# EAGLE design senseMini_future (EAGLE 9.1.1)
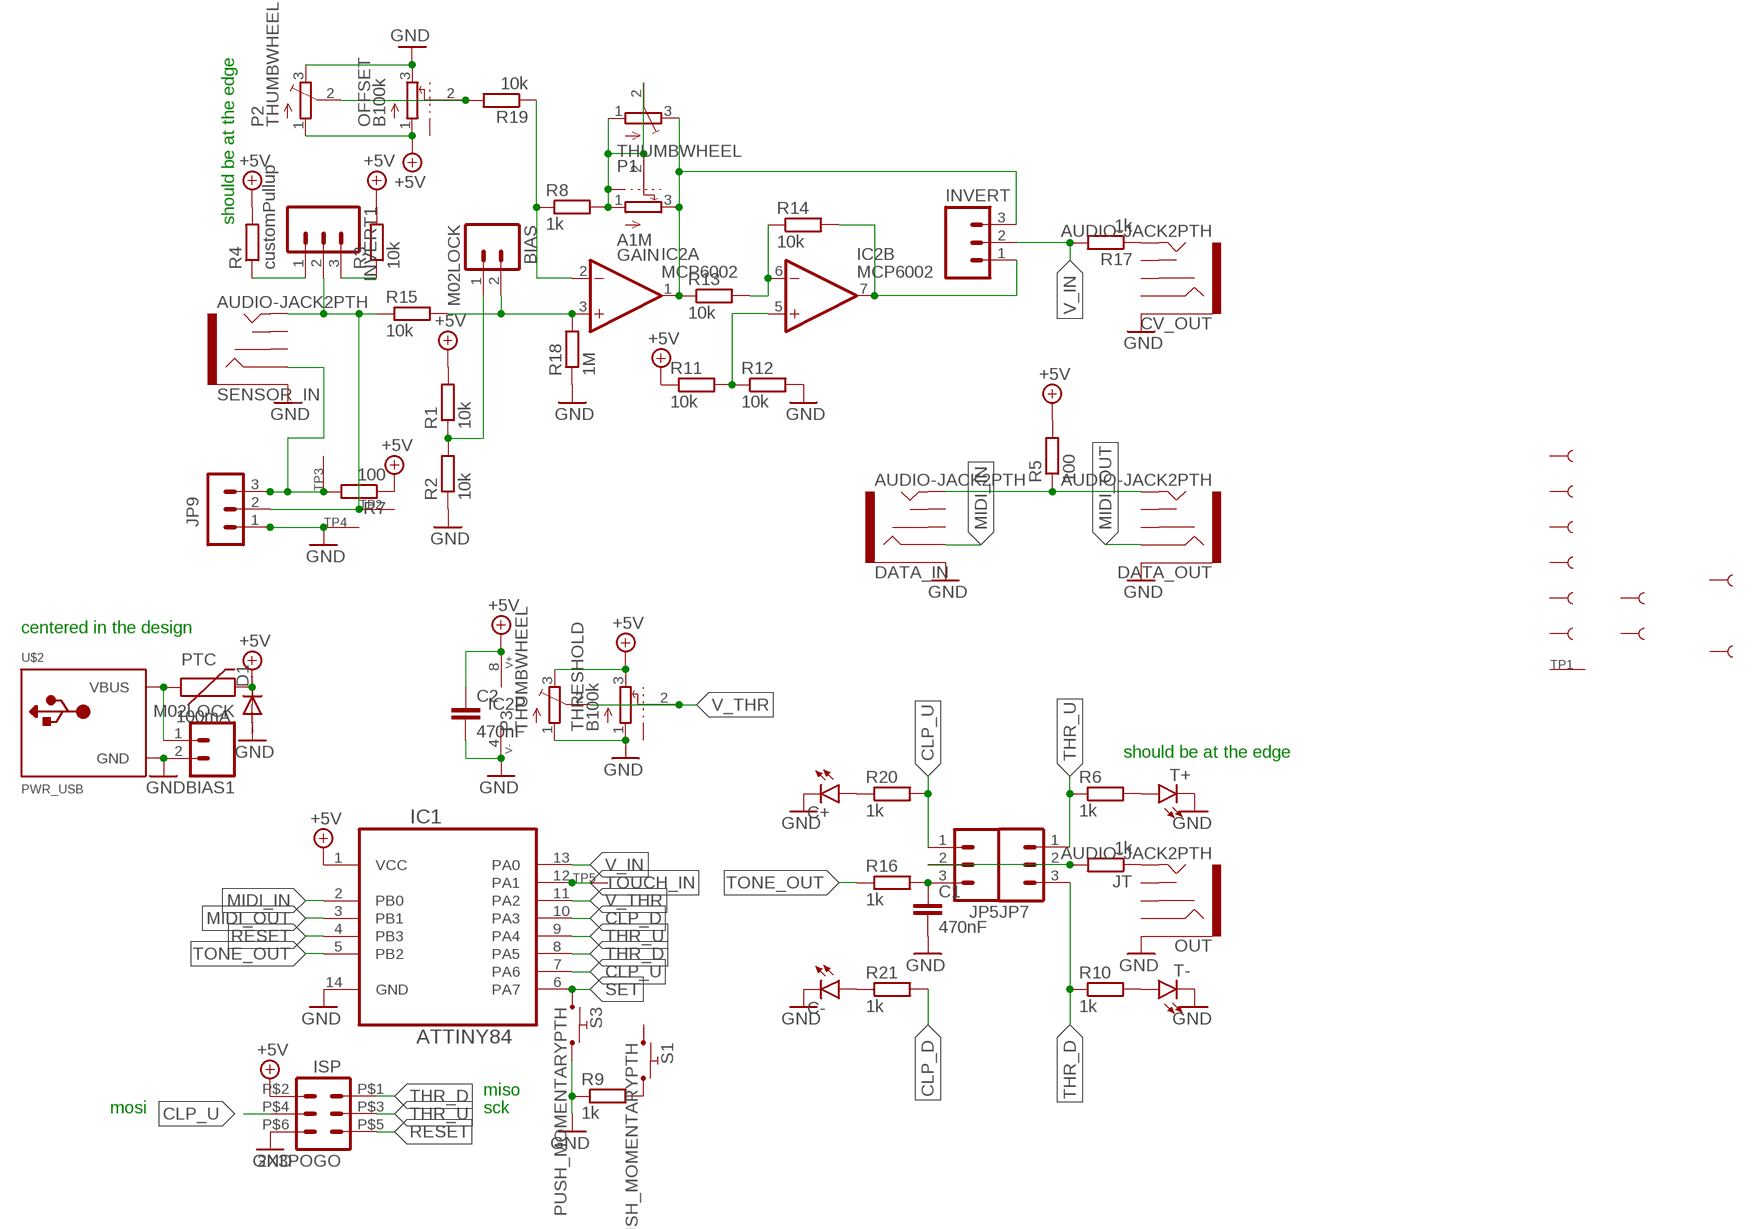
[diagram p0: schematic, sheet 1]

## Parts
BIAS  M02LOCK  [1X02_LOCK]
BIAS1  M02LOCK  [1X02_LOCK]
C1  470nF  CAPACITOR_CERAMIC_THT050-024X044  [C_C050-024X044]
C2  470nF  CAPACITOR_CERAMIC_THT050-024X044  [C_C050-024X044]
C+  LED_THT  [LEDSMALLHOLES]
C-  LED_THT  [LEDSMALLHOLES]
CV_OUT  AUDIO-JACK2PTH  [AUDIO-JACK]
D1  DIODE-D-5  [D-5]
DATA_IN  AUDIO-JACK2PTH  [AUDIO-JACK]
DATA_OUT  AUDIO-JACK2PTH  [AUDIO-JACK]
GAIN  A1M  POT_ALPHAPOT_ALPHA  [POT_ALPHA]
IC1  ATTINY84  ATTINY84-20PU  [DIP254P762X533-14]
IC2  MCP6002  TL072  [DIL08]
INVERT  M03LOCK  [1X03_LOCK]
INVERT1  M03LOCK  [1X03_LOCK]
ISP  2X3POGO  [2X3_POGO]
JP5  M03LOCK  [1X03_LOCK]
JP7  M03LOCK  [1X03_LOCK]
JP9  1X3_FEMALE  [HEADER_1X3_FEMALE]
JT  1k  RESISTOR_0204_THT0204/5  [RCL_0204/5]
OFFSET  B100k  POT_ALPHAPOT_ALPHA  [POT_ALPHA]
OUT  AUDIO-JACK2PTH  [AUDIO-JACK]
P1  THUMBWHEEL  [THUMBWHEEL]
P2  THUMBWHEEL  [THUMBWHEEL]
P3  THUMBWHEEL  [THUMBWHEEL]
PTC  100mA  PTC_THTPTH  [PTC_THT]
R1  10k  RESISTOR_0204_THT0204/5  [RCL_0204/5]
R2  10k  RESISTOR_0204_THT0204/5  [RCL_0204/5]
R3  10k  RESISTOR_0204_THT0204/5  [RCL_0204/5]
R4  customPullup  RESISTOR_0204_THT0204/5  [RCL_0204/5]
R5  100  RESISTOR_0204_THT0204/5  [RCL_0204/5]
R6  1k  RESISTOR_0204_THT0204/5  [RCL_0204/5]
R7  100  RESISTOR_0204_THT0204/5  [RCL_0204/5]
R8  1k  RESISTOR_0204_THT0204/5  [RCL_0204/5]
R9  1k  RESISTOR_0204_THT0204/5  [RCL_0204/5]
R10  1k  RESISTOR_0204_THT0204/5  [RCL_0204/5]
R11  10k  RESISTOR_0204_THT0204/5  [RCL_0204/5]
R12  10k  RESISTOR_0204_THT0204/5  [RCL_0204/5]
R13  10k  RESISTOR_0204_THT0204/5  [RCL_0204/5]
R14  10k  RESISTOR_0204_THT0204/5  [RCL_0204/5]
R15  10k  RESISTOR_0204_THT0204/5  [RCL_0204/5]
R16  1k  RESISTOR_0204_THT0204/5  [RCL_0204/5]
R17  1k  RESISTOR_0204_THT0204/5  [RCL_0204/5]
R18  1M  RESISTOR_0204_THT0204/5  [RCL_0204/5]
R19  10k  RESISTOR_0204_THT0204/5  [RCL_0204/5]
R20  1k  RESISTOR_0204_THT0204/5  [RCL_0204/5]
R21  1k  RESISTOR_0204_THT0204/5  [RCL_0204/5]
S1  PUSH_MOMENTARYPTH  [TACTILE-PTH]
S3  PUSH_MOMENTARYPTH  [TACTILE-PTH]
SENSOR_IN  AUDIO-JACK2PTH  [AUDIO-JACK]
T+  LED_THT  [LEDSMALLHOLES]
T-  LED_THT  [LEDSMALLHOLES]
THRESHOLD  B100k  POT_ALPHAPOT_ALPHA  [POT_ALPHA]
TP1  SEWTAP-2.0IN  [SEWINGTAP_2.0]
TP2  SEWTAP0.5IN  [SEWINGTAP_0.5]
TP3  SEWTAP0.5IN  [SEWINGTAP_0.5]
TP4  SEWTAP0.5IN  [SEWINGTAP_0.5]
TP5  SEWTAP0.5IN  [SEWINGTAP_0.5]
U$2  PWR_USB  [USBMICRO]
U$3  SEWTAP2  [PETAL-LONG-2]
U$4  SEWTAP2  [PETAL-LONG-2]
U$5  SEWTAP6  [PETAL-SMALL-2SIDE]
U$6  SEWTAP6  [PETAL-SMALL-2SIDE]
U$7  SEWTAP6  [PETAL-SMALL-2SIDE]
U$8  SEWTAP6  [PETAL-SMALL-2SIDE]
U$9  SEWTAP2  [PETAL-LONG-2]
U$10  SEWTAP2  [PETAL-LONG-2]
U$11  SEWTAP2  [PETAL-LONG-2]
U$12  SEWTAP2  [PETAL-LONG-2]

## Nets
+5V: C2.1 D1.C IC1.1(VCC) IC2.8(P:V+) ISP.P$2 OFFSET.1 P2.1(A) P3.3(E) PTC.P$2 R1.2 R3.2 R4.2 R5.2 R7.1 R11.1 THRESHOLD.3
CLP_D: IC1.10(PA3) R21.2
CLP_U: IC1.7(PA6) ISP.P$4 JP5.1 R20.2
GND: BIAS1.2 C1.2 C2.2 C+.K(C) C-.K(C) CV_OUT.SLEEVE D1.A DATA_IN.SLEEVE DATA_OUT.SLEEVE IC1.14(GND) IC2.4(P:V-) ISP.P$6 JP9.1 OFFSET.3 OUT.SLEEVE P2.3(E) P3.1(A) R2.1 R9.1 R12.2 R18.1 S3.3 S3.4 SENSOR_IN.SLEEVE T+.K(C) T-.K(C) THRESHOLD.1 TP4.TAP(SEW) U$2.GND U$2.GND1(GND)
MIDI_IN: DATA_IN.RING IC1.2(PB0)
MIDI_OUT: DATA_OUT.RING IC1.3(PB1)
N$1: BIAS1.1 PTC.P$1 U$2.V+1(VBUS) U$2.V+(VBUS)
N$2: INVERT1.1 R4.1
N$3: BIAS.1 R1.1 R2.2
N$4: INVERT1.3 R3.1
N$5: C+.A R20.1
N$6: DATA_IN.TIP DATA_OUT.TIP R5.1
N$7: JP9.3 R7.2 SENSOR_IN.RING TP3.TAP(SEW)
N$8: INVERT1.2 JP9.2 R15.1 SENSOR_IN.TIP TP2.TAP(SEW)
N$9: R6.2 T+.A
N$10: JP5.2 JP7.2 JT.2
N$11: GAIN.3 IC2.1(A:OUT) INVERT.3 P1.3(E) R13.1
N$12: C1.1 JP5.3 R16.2
N$13: R10.2 T-.A
N$14: GAIN.1 GAIN.2 GAIN.P$1 GAIN.P$2 P1.1(A) P1.2(S) R8.2
N$15: BIAS.2 IC2.3(A:+IN) R15.2 R18.2
N$16: R9.2 S1.3 S1.4
N$17: C-.A R21.1
N$19: IC2.5(B:+IN) R11.2 R12.1
N$20: IC2.6(B:-IN) R13.2 R14.1
N$21: IC2.7(B:OUT) INVERT.1 R14.2
N$23: JT.1 OUT.TIP
N$26: CV_OUT.TIP R17.1
N$27: IC2.2(A:-IN) R8.1 R19.1
N$28: OFFSET.2 P2.2(S) R19.2
RESET: IC1.4(PB3) ISP.P$5
SET: IC1.6(PA7) S3.1 S3.2
THR_D: IC1.8(PA5) ISP.P$1 JP7.3 R10.1
THR_U: IC1.9(PA4) ISP.P$3 JP7.1 R6.1
TONE_OUT: IC1.5(PB2) R16.1
TOUCH_IN: IC1.12(PA1) TP5.TAP(SEW)
V_IN: IC1.13(PA0) INVERT.2 R17.2
V_THR: IC1.11(PA2) P3.2(S) THRESHOLD.2
Unconnected: CV_OUT.RING CV_OUT.RSH CV_OUT.TSH DATA_IN.RSH DATA_IN.TSH DATA_OUT.RSH DATA_OUT.TSH OFFSET.P$1 OFFSET.P$2 OUT.RING OUT.RSH OUT.TSH S1.1 S1.2 SENSOR_IN.RSH SENSOR_IN.TSH THRESHOLD.P$1 THRESHOLD.P$2 TP1.P$1(SEW) U$3.1 U$4.1 U$5.1 U$6.1 U$7.1 U$8.1 U$9.1 U$10.1 U$11.1 U$12.1

## Notes on the sheet
- should be at the edge
- centered in the design
- should be at the edge
- miso
- mosi | sck

## Library data of the parts
BIAS BIAS1 = BASTL_PINHEADERS:M02: Standard 2-pin 0.1" header. Use with - straight break away headers ( PRT-00116) - right angle break away headers (PRT-00553) - swiss pins (PRT-00743) - machine pins (PRT-00117) - female headers (PRT-00115) Molex polarized connector foot print use with: PRT-08233 with associated crimp pins and housings. 2.54_SCREWTERM for use with PRT-10571. 3.5mm Screw Terminal footprints for PRT-08084 5mm Screw Terminal footprints for use with PRT-08433
C1 C2 = BASTL_CAPACITORS:CAPACITOR_CERAMIC_THT: CAPACITOR, European symbol
C+ C- T+ T- = BASTL_LEDS:LED_THT: [color]_[diameter]_[difused/clear] R_3mm_D; ASSEMBLED: yes; TYPE: THT
CV_OUT DATA_IN DATA_OUT OUT SENSOR_IN = SparkFun-Connectors:AUDIO-JACK2: Stereo audio jack with bypass switches. SMT version used on LilyPad MP3 board.; PROD_ID: CONN-08774
D1 = diode:DIODE-: DIODE
GAIN OFFSET THRESHOLD = BASTL_POTS:POT_ALPHA: "A/B""value"_"height"_"D(centrer detent)"_"W(white mark)"; ASSEMBLED: yes; TYPE: THT
IC1 = Atmel_By_element14_Batch_1-00:ATTINY84-20PU: 8-bit Microcontroller with In-System Programmable Flash; MPN: ATTINY84-20PU; OC_FARNELL: -; OC_NEWARK: 58M3794; PACKAGE: PDIP-14; SUPPLIER: Atmel
IC2 = BASTL_ICS:TL072
INVERT INVERT1 JP5 JP7 = BASTL_PINHEADERS:M03: Header 3 Standard 3-pin 0.1" header. Use with straight break away headers (SKU : PRT-00116), right angle break away headers (PRT-00553), swiss pins (PRT-00743), machine pins (PRT-00117), and female headers (PRT-00115). Molex polarized connector foot print use with SKU : PRT-08232 with associated crimp pins and housings.
ISP = BASTL_CONNECTORS:2X3POGO
JP9 = BASTL_PINHEADERS:1X3_FEMALE; ASSEMBLED: yes; TYPE: THT
JT R1-R21 = BASTL_RESISTORS:RESISTOR_0204_THT: RESISTOR, European symbol
P1-P3 = BASTL_POTS:THUMBWHEEL; ASSEMBLED: yes; TYPE: THT
PTC = BASTL_FUSES:PTC_THT: Resettable Fuse PTC Resettable Fuse. Spark Fun Electronics SKU : COM-08357
S1 S3 = BASTL_SWITCHES:PUSH_MOMENTARY: Various NO switches- pushbuttons, reed, etc; ASSEMBLED: yes; TYPE: THT
TP1-TP5 = adafruit:SEWTAP
U$2 = BASTL_CONNECTORS:PWR_USB; ASSEMBLED: yes; MAN: Amphenol; MPN: 10103593-0001LF; ODOO: USB MICRO 2.0 connector; TYPE: SMT
U$3-U$12 = LilyPad-Wearables:SEWTAP

## Board
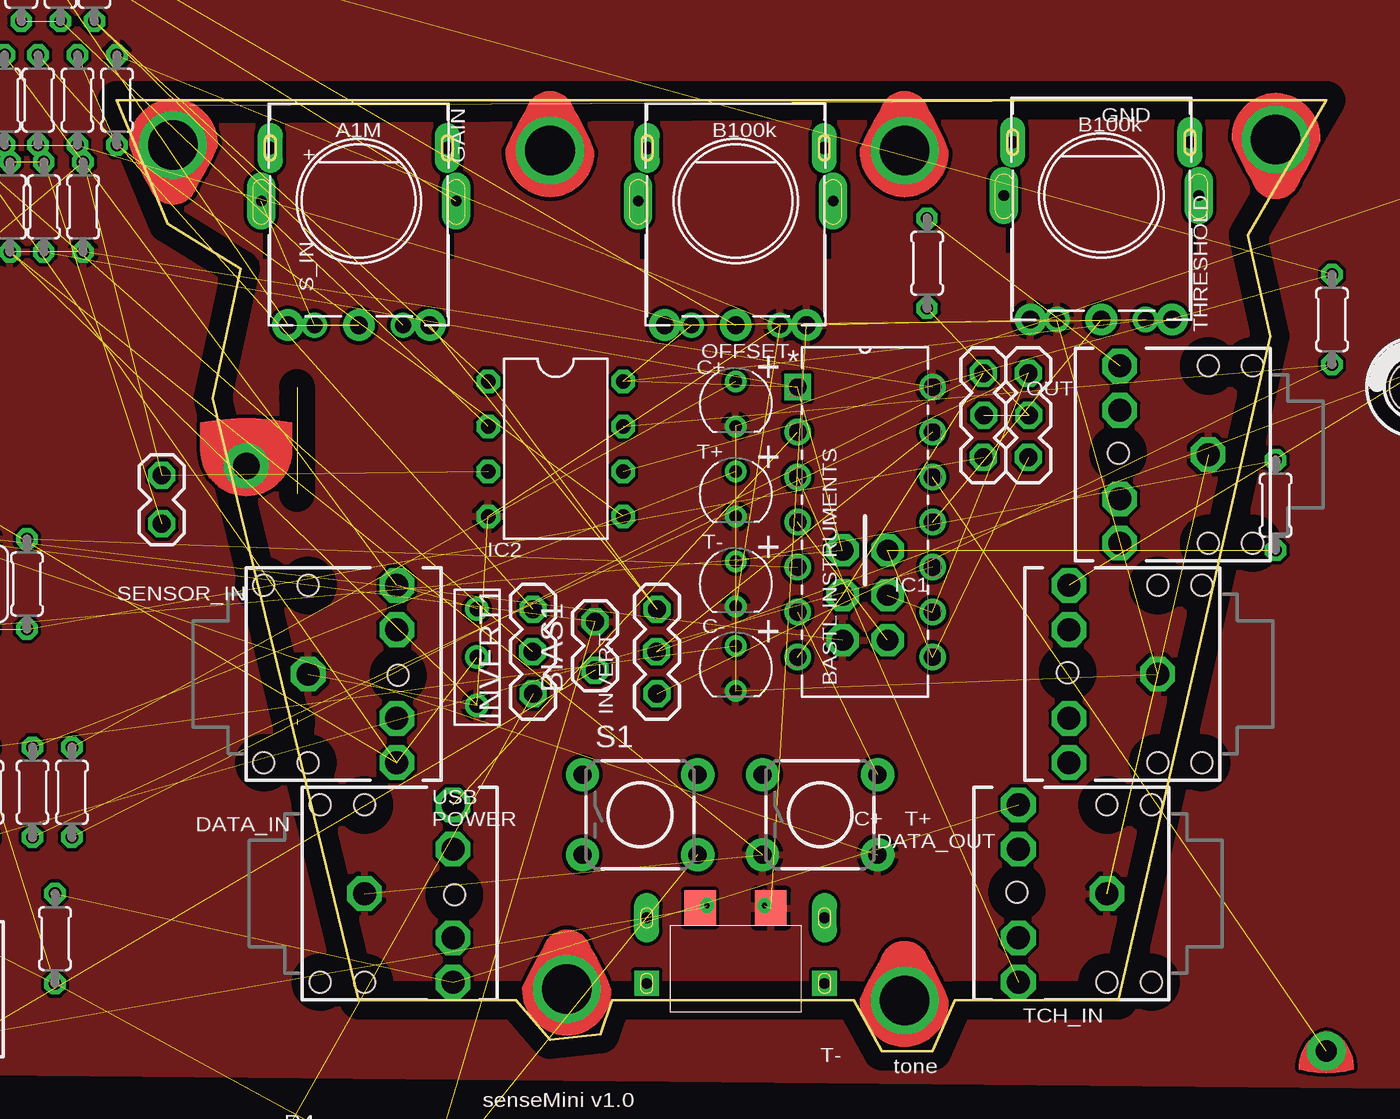
[diagram p1: board, top side]
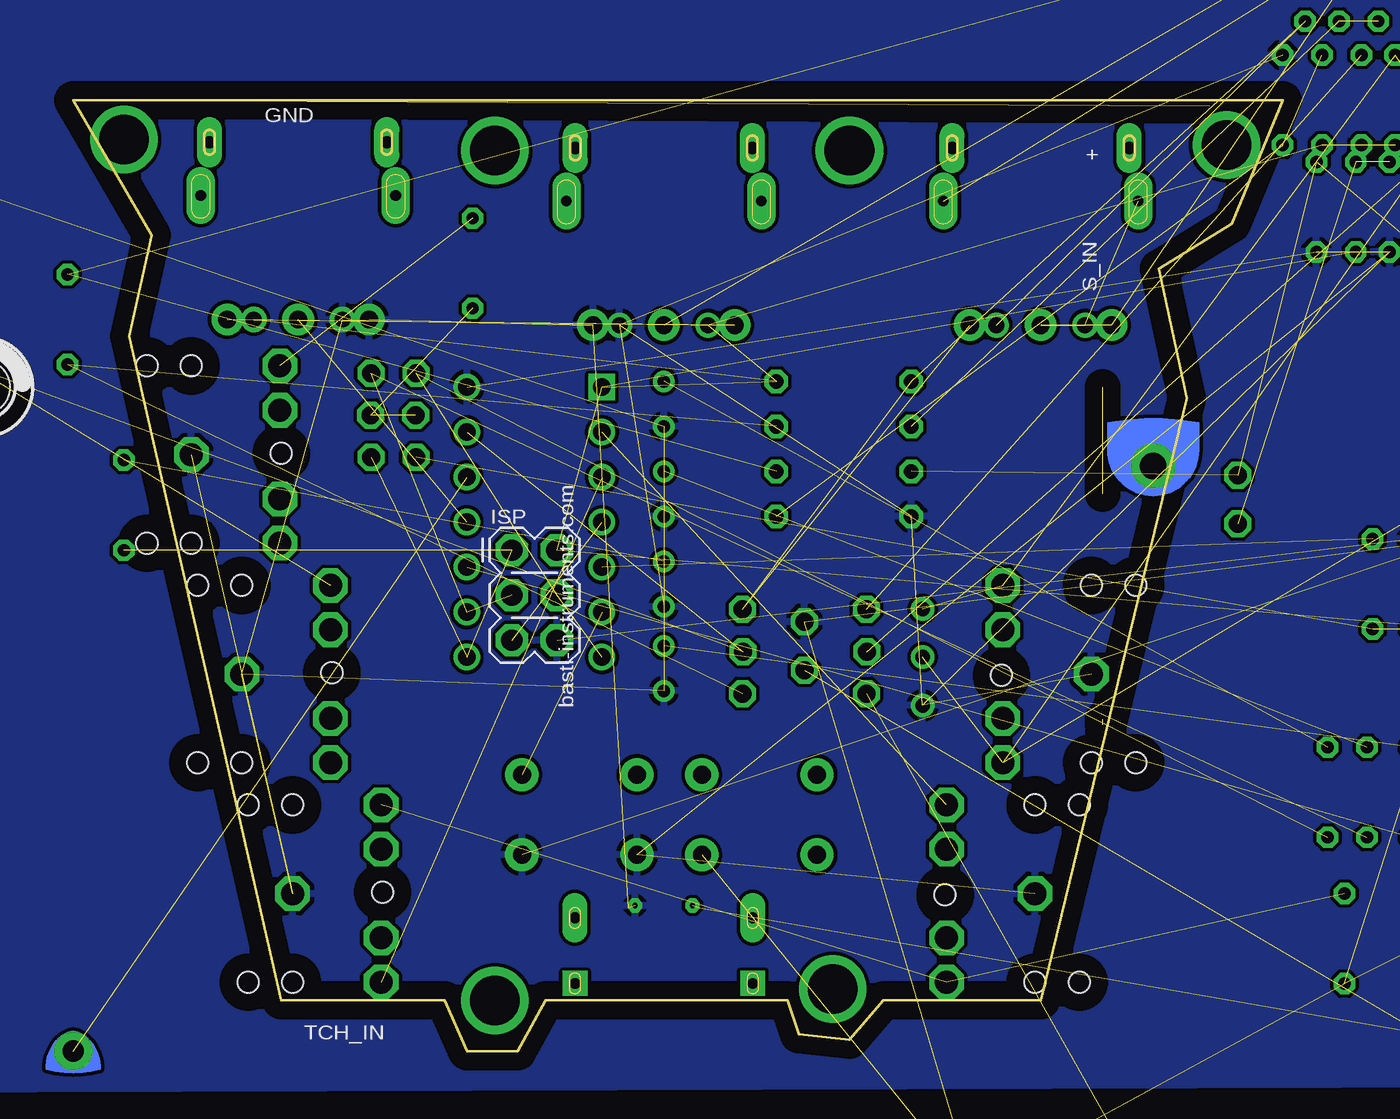
[diagram p2: board, bottom side, seen from below]

Size 68.26 x 53.66 mm. Coordinates in mm from the lower left corner, seen from the top.
Outline: 10.16,37.47 10.16,36.83 10.16,31.43
Outline: 10.16,18.73 10.16,18.41
Outline: 66.36,53.66 4.13,53.34
Outline: 13.65,2.86 22.54,2.86 24.45,0.63 27.3,0.95 27.94,2.86 41.59,2.86 43.18,0 46.04,0 47.31,2.86 56.52,2.86 65.09,40.32 63.82,46.04 68.26,53.66 0,53.66 2.86,46.67 6.99,44.13 5.4,36.83 13.65,2.86
Copper layers (1*16): Top 0.035mm / dielectric 1.5mm / Bottom 0.035mm
Design rules "default": minimum track width 10mil, minimum drill 24mil, track to track 8mil, track to pad 8mil, pad to pad 8mil, via to via 8mil, smd to smd 8mil, copper to edge 40mil, drill to drill 8mil, minimum pad ring 10mil, minimum via ring 8mil, stop-mask expansion 4mil, vias tented up to drill 0mil, thermal gap 10mil

### Footprints (pad centres in the part's own frame; a part is rotated, then mirrored left to right if it is on the bottom)
1X02_LOCK = drill 1.016 octagon: 1 -0.098,0; 2 2.638,0
C_C050-024X044 = drill 0.7 octagon: 1 -2.54,0; 2 2.54,0
LEDSMALLHOLES = drill 0.7 pad 1.143: A -1.27,0; K 1.27,0
AUDIO-JACK = drill 1.3 octagon: RING 5,5; RSH 5,2.5; SLEEVE 0,0; TIP 5,-5; TSH 5,-2.5 | hole 1.2: 0,5; -2.5,5; -2.5,-5; 0,-5; 5.08,-0.08
D-5 = drill 0.813 octagon: A 2.54,0; C -2.54,0
POT_ALPHA = drill 0.9 pad 1.422: 1 -2.5,0; 2 0,0; 3 2.5,0 | drill 0.6 pad 1.6 long: P$1 -5.5,7; P$2 5.5,7
DIP254P762X533-14 = drill 0.991 square: 1 -7.62,15.24 | drill 0.991: 2 -7.62,12.7; 3 -7.62,10.16; 4 -7.62,7.62; 5 -7.62,5.08; 6 -7.62,2.54; 7 -7.62,0; 8 0,0; 9 0,2.54; 10 0,5.08; 11 0,7.62; 12 0,10.16; 13 0,12.7; 14 0,15.24
DIL08 = drill 0.813 octagon: 1 -3.81,-3.81; 2 -1.27,-3.81; 3 1.27,-3.81; 4 3.81,-3.81; 5 3.81,3.81; 6 1.27,3.81; 7 -1.27,3.81; 8 -3.81,3.81
1X03_LOCK = drill 1.016 octagon: 1 0.167,0; 2 2.54,0.032; 3 4.921,0
2X3_POGO = drill 1.2 pad 1.829 octagon: P$1 0,0; P$2 0,2.54; P$3 2.54,0; P$4 2.54,2.54; P$5 5.08,0; P$6 5.08,2.54
HEADER_1X3_FEMALE = drill 0.813: 1 -2.718,0; 2 0,0; 3 2.718,0
RCL_0204/5 = drill 0.7 octagon: 1 -2.54,0; 2 2.54,0
THUMBWHEEL = drill 1 pad 1.778: 1 -4,0; 2 0,0; 3 4,0 | drill 0.7 pad 1.422 long: P$4 -5,10; P$5 5,10
PTC_THT = drill 0.8 pad 1.88: P$1 -2.54,0; P$2 2.54,0
TACTILE-PTH = drill 1.016 pad 1.88: 1 -3.251,2.261; 2 3.251,2.261; 3 -3.251,-2.261; 4 3.251,-2.261
SEWINGTAP_2.0 = drill 1.5 pad 2.54: P$1 0,0
SEWINGTAP_0.5 = drill 1.2 pad 2.184: TAP 0,0
3MM_HOLE = hole 3: 0,0
USBMICRO = smd 1.778 x 2: GND 1.986,5.85; V+ -2.011,5.85 | drill 0.3 octagon: GND1 1.624,5.991; V+1 -1.624,5.991 | drill 0.6 pad 1.4 long: P$1 -5.021,5.3; P$5 5.012,5.3 | drill 0.6 pad 1.4 square: P$3 -5.021,1.6; P$6 5.012,1.6
PETAL-LONG-2 = drill 2.794: 1 0,0
PETAL-SMALL-2SIDE = drill 2.2: 1 0,0

### Placement (x,y rotation side)
BIAS  2.54,29.84 90 top
BIAS1  26.99,21.59 90 top
C1  -7.3,26.35 90 top  (outside the outline)
C2  -9.84,26.35 90 top  (outside the outline)
C+  34.92,36.51 270 top
C-  34.92,21.59 270 top
CV_OUT  58.74,21.27 180 top
D1  11.43,-19.37 0 top  (outside the outline)
DATA_IN  13.97,8.89 0 top
DATA_OUT  55.88,8.89 180 top
GAIN  13.65,40.96 0 top
IC1  46.04,22.23 0 top
IC2  24.77,33.97 270 top
INVERT  30.48,20 90 top
INVERT1  23.5,20 90 top
ISP  43.5,28.26 270 bottom
JP5  48.89,38.42 270 top
JP7  51.44,38.42 270 top
JP9  20.32,22.23 90 top
JT  45.72,44.45 270 top
OFFSET  34.92,40.96 0 top
OUT  61.59,33.66 180 top
P1  13.65,40.96 0 top
P2  34.92,40.96 0 top
P3  55.56,41.27 0 top
PTC  -7.94,3.49 90 top  (outside the outline)
R1  -4.13,47.62 270 top  (outside the outline)
R2  -6.03,47.62 90 top  (outside the outline)
R3  -4.45,53.66 270 top  (outside the outline)
R4  11.43,-5.71 0 top  (outside the outline)
R5  -3.49,6.35 270 top  (outside the outline)
R6  -4.76,14.61 90 top  (outside the outline)
R7  -6.35,53.66 90 top  (outside the outline)
R8  -5.4,60.64 90 top  (outside the outline)
R9  2.54,-23.18 0 top  (outside the outline)
R10  65.41,30.8 90 top
R11  -2.22,53.66 90 top
R12  0,53.66 90 top
R13  -1.27,60.64 90 top  (outside the outline)
R14  68.58,41.27 270 top
R15  -7.94,47.62 270 top  (outside the outline)
R16  -5.08,26.35 270 top  (outside the outline)
R17  94.93,48.9 270 top  (outside the outline)
R18  -1.9,47.62 90 top
R19  -3.18,60.64 90 top  (outside the outline)
R20  -2.54,14.61 270 top
R21  -7.3,14.61 270 top  (outside the outline)
S1  29.53,13.33 0 top
S3  39.69,13.33 0 top
SENSOR_IN  10.79,21.27 0 top
T+  34.92,31.43 270 top
T-  34.92,26.35 270 top
THRESHOLD  55.56,41.27 0 top
TP1  7.3,33.02 0 top
TP2  -18.1,36.51 90 top  (outside the outline)
TP3  -14.29,44.13 90 top  (outside the outline)
TP4  111.12,61.28 270 top  (outside the outline)
TP5  68.26,0 180 top
U$1  [3MM_HOLE]  73.34,37.47 0 top  (outside the outline)
U$2  34.92,2.22 0 top
U$3  3.17,51.12 180 top
U$4  65.41,51.44 180 top
U$5  142.56,49.21 90 top  (outside the outline)
U$6  98.11,49.53 270 top  (outside the outline)
U$7  142.56,43.82 90 top  (outside the outline)
U$8  98.11,44.13 270 top  (outside the outline)
U$9  25.4,3.49 0 top
U$10  44.45,2.86 0 top
U$11  44.45,50.8 0 top
U$12  24.45,50.8 0 top

### Tracks (layer width: path | path; a pad name or v marks a point on that pad's centre or on a via)
+5V  (15 unrouted)
CLP_D  (1 unrouted)
CLP_U  (3 unrouted)
GND  (28 unrouted)
  pour Bottom: -11.48,-1.87 160.36,-2.46 159.82,74.34 -11.12,75.19
  pour Top: -19.32,-1.06 182.63,-2.96 181.72,79.96 -18.19,80.61
MIDI_IN  (1 unrouted)
MIDI_OUT  (1 unrouted)
N$1  (3 unrouted)
N$2  (1 unrouted)
N$3  (2 unrouted)
N$4  (1 unrouted)
N$5  (1 unrouted)
N$6  (2 unrouted)
N$7  (3 unrouted)
N$8  (4 unrouted)
N$9  (1 unrouted)
N$10  (2 unrouted)
N$11  (4 unrouted)
N$12  (2 unrouted)
N$13  (1 unrouted)
N$14  (5 unrouted)
N$15  (3 unrouted)
N$16  (1 unrouted)
N$17  (1 unrouted)
N$19  (2 unrouted)
N$20  (2 unrouted)
N$21  (2 unrouted)
N$23  (1 unrouted)
N$26  (1 unrouted)
N$27  (2 unrouted)
N$28  (1 unrouted)
RESET  (1 unrouted)
SET  (1 unrouted)
THR_D  (3 unrouted)
THR_U  (3 unrouted)
TONE_OUT  (1 unrouted)
TOUCH_IN  (1 unrouted)
V_IN  (2 unrouted)
V_THR  (1 unrouted)

### Text on the board
tPlace: GND | + | S_IN | BASTL INSTRUMENTS | USB / POWER | C+ | T+ | TCH_IN | T- | tone | senseMini v1.0 | + | IN
bPlace: GND | + | S_IN | senseMini v1.0 | bastl-instruments.com | TCH_IN